# EAGLE design GrblPiArgentina (EAGLE 6.4)
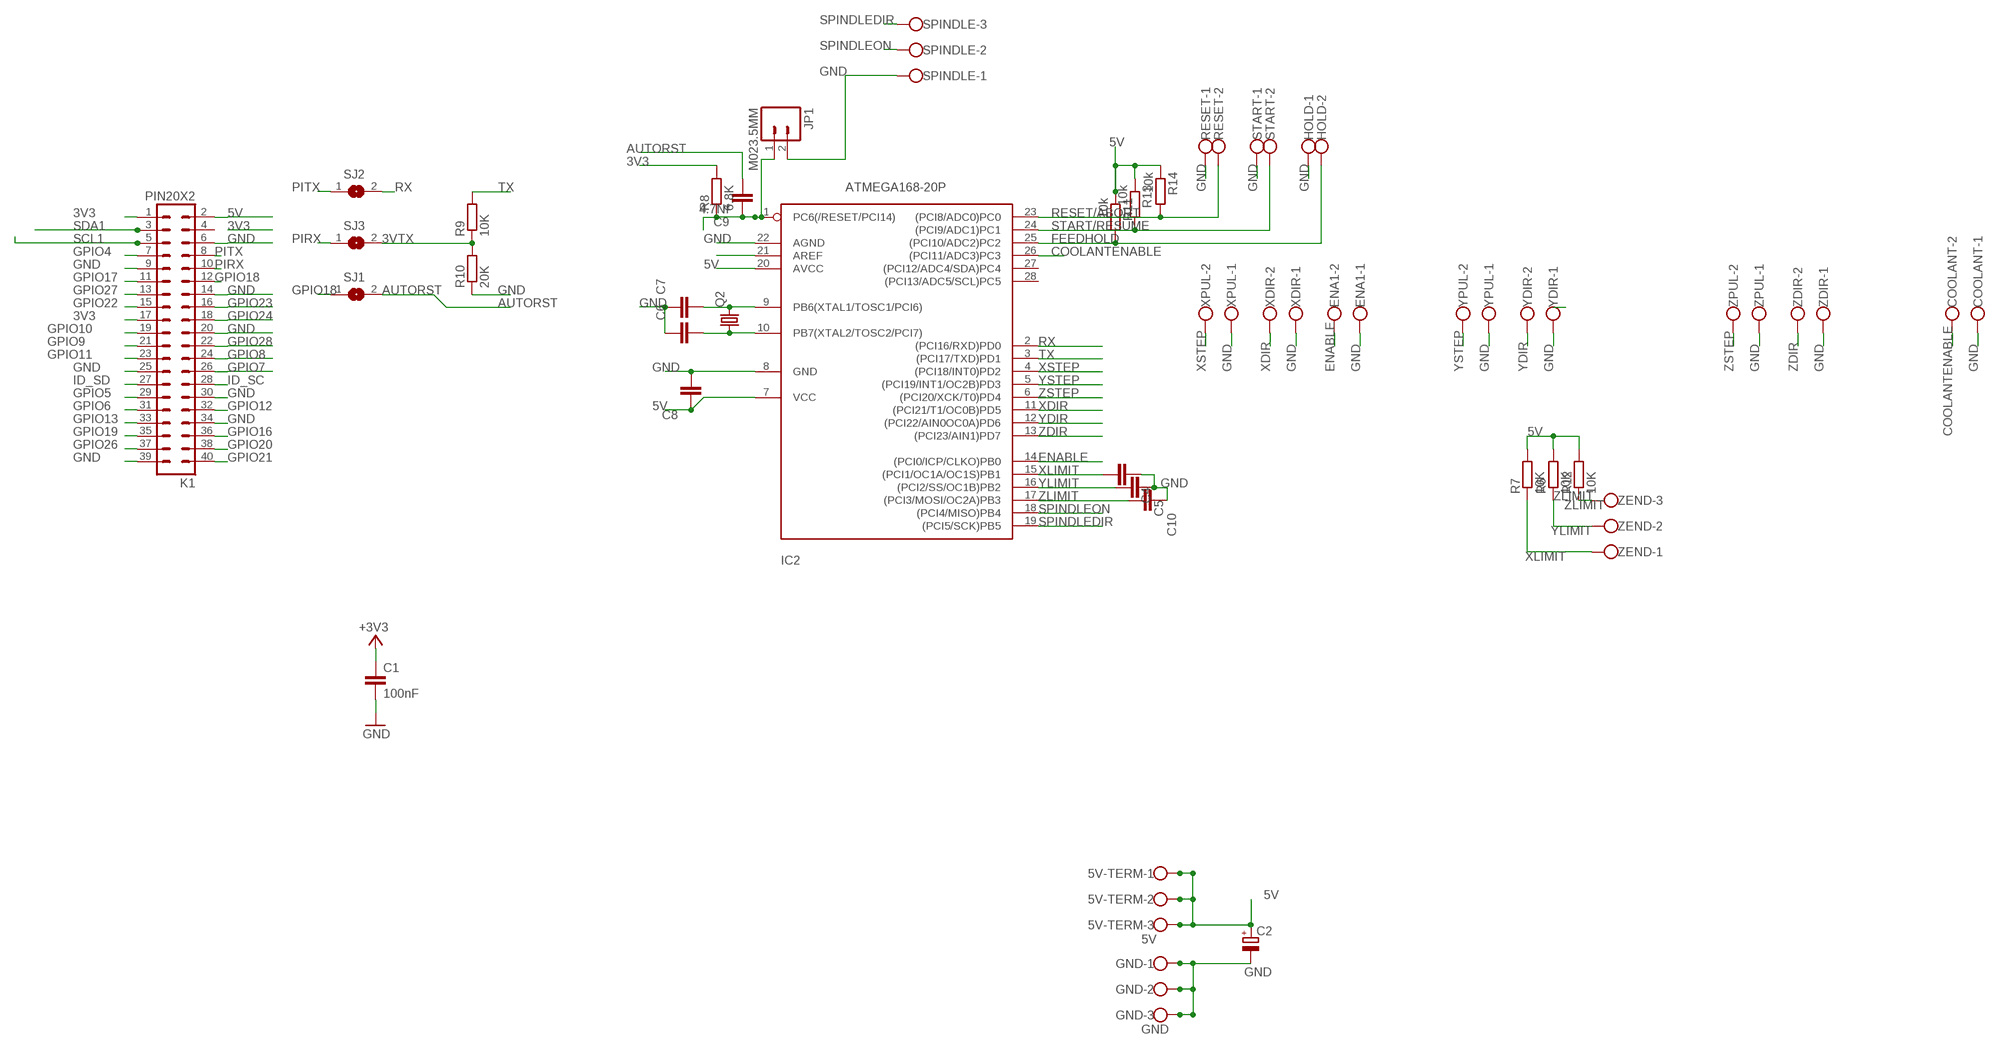
[diagram p0: schematic, sheet 1]

## Parts
5V-TERM  5V  W237-103  [W237-103]
C1  100nF  C-EU025-024X044  [C025-024X044]
C2  CPOL-EUE2,5-6E  [E2,5-6E]
C4  CAPACITOR_NPOL-PTH_0.1"  [C0.1PTH]
C5  CAPACITOR_NPOL-PTH_0.1"  [C0.1PTH]
C6  CAPACITOR_NPOL-PTH_0.1"  [C0.1PTH]
C7  CAPACITOR_NPOL-PTH_0.1"  [C0.1PTH]
C8  CAPACITOR_NPOL-PTH_0.1"  [C0.1PTH]
C9  4.7Nf  CAPACITOR_NPOL-PTH_0.1"  [C0.1PTH]
C10  CAPACITOR_NPOL-PTH_0.1"  [C0.1PTH]
COOLANT  W237-102  [W237-102]
ENA1  W237-102  [W237-102]
GND  GND  W237-103  [W237-103]
HOLD  W237-102  [W237-102]
IC2  ATMEGA168-20P  [DIL28-3]
JP1  M023.5MM  [SCREWTERMINAL-3.5MM-2]
K1  PIN20X2  [PIN_20X2]
Q2  CRYSTALHC49U70  [HC49U70]
R6  10K  R-EU_0204/7  [0204/7]
R7  10K  R-EU_0204/7  [0204/7]
R8  6.8K  R-EU_0204/7  [0204/7]
R9  10K  R-EU_0204/7  [0204/7]
R10  20K  R-EU_0204/7  [0204/7]
R11  10k  R-EU_0204/7  [0204/7]
R12  10K  R-EU_0204/7  [0204/7]
R13  10k  R-EU_0204/7  [0204/7]
R14  10k  R-EU_0204/7  [0204/7]
RESET  W237-102  [W237-102]
SJ1  SJ  [SJ]
SJ2  SJ  [SJ]
SJ3  SJ  [SJ]
SPINDLE  W237-103  [W237-103]
START  W237-102  [W237-102]
XDIR  W237-102  [W237-102]
XPUL  W237-102  [W237-102]
YDIR  W237-102  [W237-102]
YPUL  W237-102  [W237-102]
ZDIR  W237-102  [W237-102]
ZEND  W237-103  [W237-103]
ZPUL  W237-102  [W237-102]

## Nets
3V3: C1.1 K1.1 K1.17 R8.2 ; supply symbol labelled +3V3
3VTX: R9.1 R10.2 SJ3.2
5V: 5V-TERM.1 5V-TERM.2 5V-TERM.3 C2.+ C8.1 IC2.7(VCC) IC2.20(AVCC) K1.2 R6.2 R7.2 R11.1 R12.2 R13.1 R14.1
AUTORST: C9.2 SJ1.2
COOLANTENABLE: COOLANT.2 IC2.26((PCI11/ADC3)PC3)
ENABLE: ENA1.2 IC2.14((PCI0/ICP/CLKO)PB0)
FEEDHOLD: HOLD.2 IC2.25((PCI10/ADC2)PC2) R11.2
GND: C1.2 C2.- C4.1 C5.1 C6.1 C7.1 C8.2 C10.1 COOLANT.1 ENA1.1 GND.1 GND.2 GND.3 HOLD.1 IC2.8(GND) IC2.22(AGND) JP1.2 K1.6 K1.9 K1.14 K1.20 K1.25 K1.30 K1.34 K1.39 R10.1 RESET.1 SPINDLE.1 START.1 XDIR.1 XPUL.1 YDIR.1 YPUL.1 ZDIR.1 ZPUL.1
GPIO4: K1.7
GPIO5: K1.29
GPIO6: K1.31
GPIO7: K1.26
GPIO8: K1.24
GPIO9: K1.21
GPIO10: K1.19
GPIO11: K1.23
GPIO12: K1.32
GPIO13: K1.33
GPIO16: K1.36
GPIO17: K1.11
GPIO18: K1.12 SJ1.1
GPIO19: K1.35
GPIO20: K1.38
GPIO21: K1.40
GPIO22: K1.15
GPIO23: K1.16
GPIO24: K1.18
GPIO26: K1.37
GPIO27: K1.13
GPIO28: K1.22
ID_SC: K1.28
ID_SD: K1.27
MCURESET1: C9.1 IC2.1(PC6(/RESET/PCI14)) JP1.1 R8.1
N$13: IC2.21(AREF)
PIRX: K1.10 SJ3.1
PITX: K1.8 SJ2.1
RESET/ABORT: IC2.23((PCI8/ADC0)PC0) R14.2 RESET.2
RX: IC2.2((PCI16/RXD)PD0) SJ2.2
SCL1: K1.5
SDA1: K1.3
SPINDLEDIR: IC2.19((PCI5/SCK)PB5) SPINDLE.3
SPINDLEON: IC2.18((PCI4/MISO)PB4) SPINDLE.2
START/RESUME: IC2.24((PCI9/ADC1)PC1) R13.2 START.2
TX: IC2.3((PCI17/TXD)PD1) R9.2
XDIR: IC2.11((PCI21/T1/OC0B)PD5) XDIR.2
XLIMIT: C4.2 IC2.15((PCI1/OC1A/OC1S)PB1) R7.1 ZEND.1
XSTEP: IC2.4((PCI18/INT0)PD2) XPUL.2
XTAL3: C6.2 IC2.10(PB7(XTAL2/TOSC2/PCI7)) Q2.1
XTAL4: C7.2 IC2.9(PB6(XTAL1/TOSC1/PCI6)) Q2.2
YDIR: IC2.12((PCI22/AIN0OC0A)PD6) YDIR.2
YLIMIT: C5.2 IC2.16((PCI2/SS/OC1B)PB2) R6.1 ZEND.2
YSTEP: IC2.5((PCI19/INT1/OC2B)PD3) YPUL.2
ZDIR: IC2.13((PCI23/AIN1)PD7) ZDIR.2
ZLIMIT: C10.2 IC2.17((PCI3/MOSI/OC2A)PB3) R12.1 ZEND.3
ZSTEP: IC2.6((PCI20/XCK/T0)PD4) ZPUL.2
Unconnected: IC2.27((PCI12/ADC4/SDA)PC4) IC2.28((PCI13/ADC5/SCL)PC5) K1.4

## Library data of the parts
5V-TERM GND SPINDLE ZEND = con-wago-500:W237-103: WAGO SCREW CLAMP; MPN: 237-103; OC_FARNELL: unknown; OC_NEWARK: 18M7116
C1 = resistor:C-EU: CAPACITOR, European symbol; DIELECTRIC: X7R
C2 = rcl:CPOL-EU: POLARIZED CAPACITOR, European symbol
C4-C10 = dp_devices:CAPACITOR_NPOL: Non-Polarized capacitor in various packages
COOLANT ENA1 HOLD RESET START XDIR XPUL YDIR YPUL ZDIR ZPUL = con-wago-500:W237-102: WAGO SCREW CLAMP; MPN: 237-102; OC_FARNELL: unknown; OC_NEWARK: 70K9898
IC2 = adafruit:ATMEGA168*P: MICROCONTROLLER 16 kBytes FLASH 1 kBytes SRAM 512 Bytes EEPROM USART 8-channel 10 bit ADC
JP1 = SparkFun-Connectors:M02: Standard 2-pin 0.1" header. Use with - straight break away headers ( PRT-00116) - right angle break away headers (PRT-00553) - swiss pins (PRT-00743) - machine pins (PRT-00117) - female headers (PRT-00115) Molex polarized connector foot print use with: PRT-08233 with associated crimp pins and housings. 2.54_SCREWTERM for use with PRT-10571. 3.5mm Screw Terminal footprints for PRT-08084 5mm Screw Terminal footprints for use with PRT-08433
K1 = FLYFISH:PIN20X2
Q2 = adafruit:CRYSTAL: CRYSTAL; OC_FARNELL: unknown; OC_NEWARK: unknown
R6-R14 = resistor:R-EU_: RESISTOR, European symbol
SJ1-SJ3 = jumper:SJ: SMD solder JUMPER

## Board
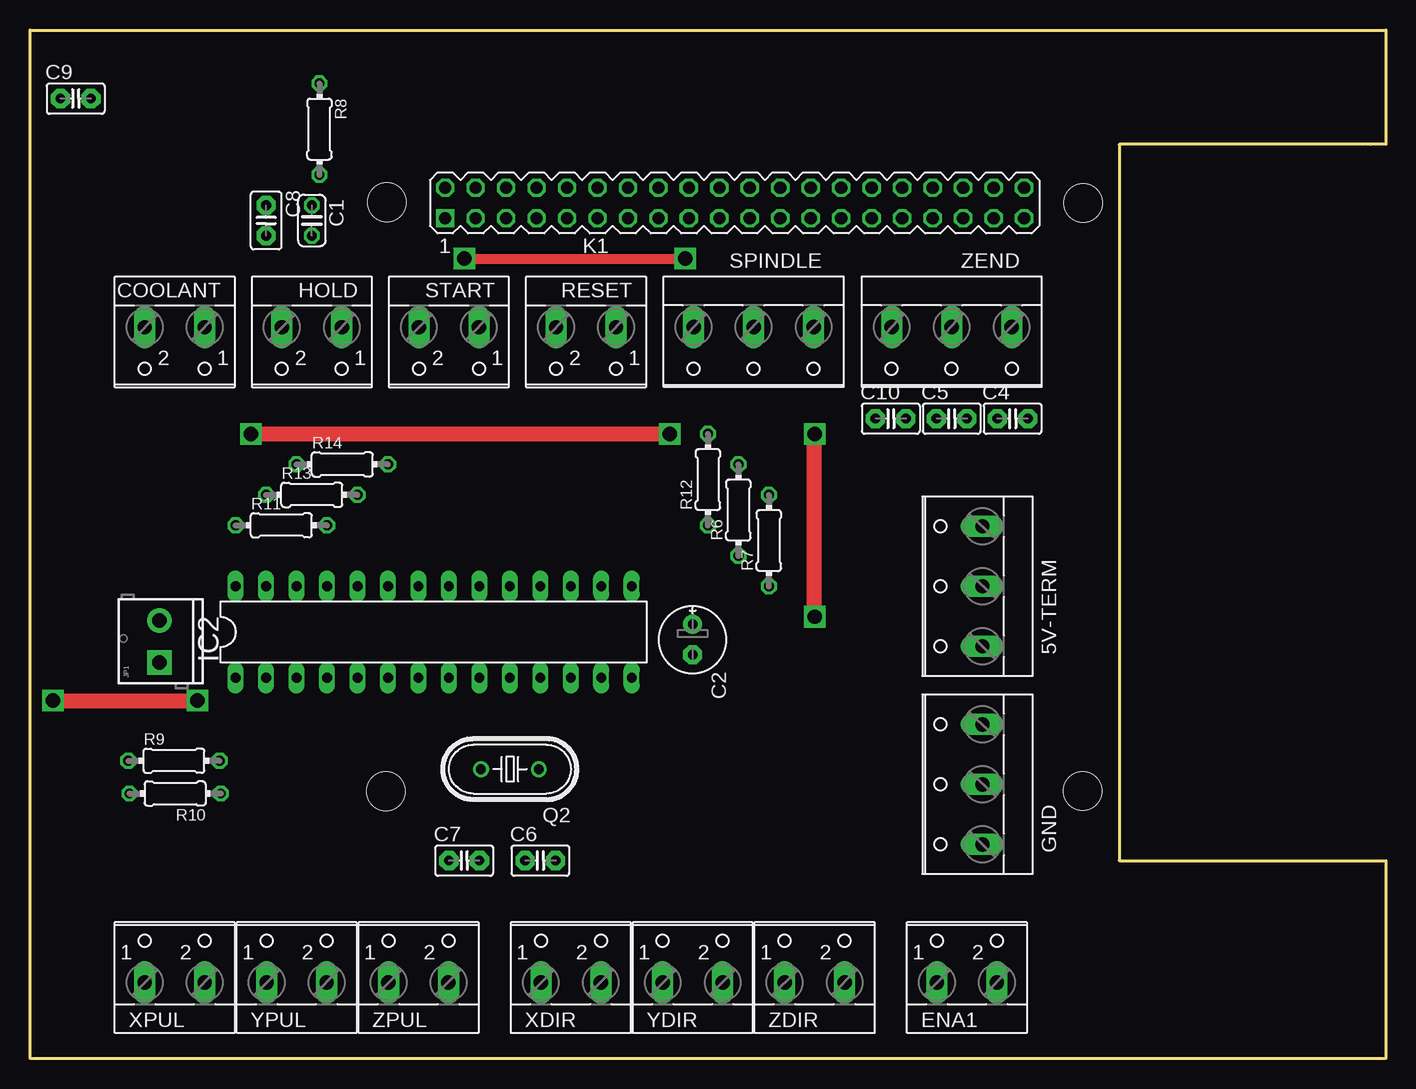
[diagram p1: board, top side]
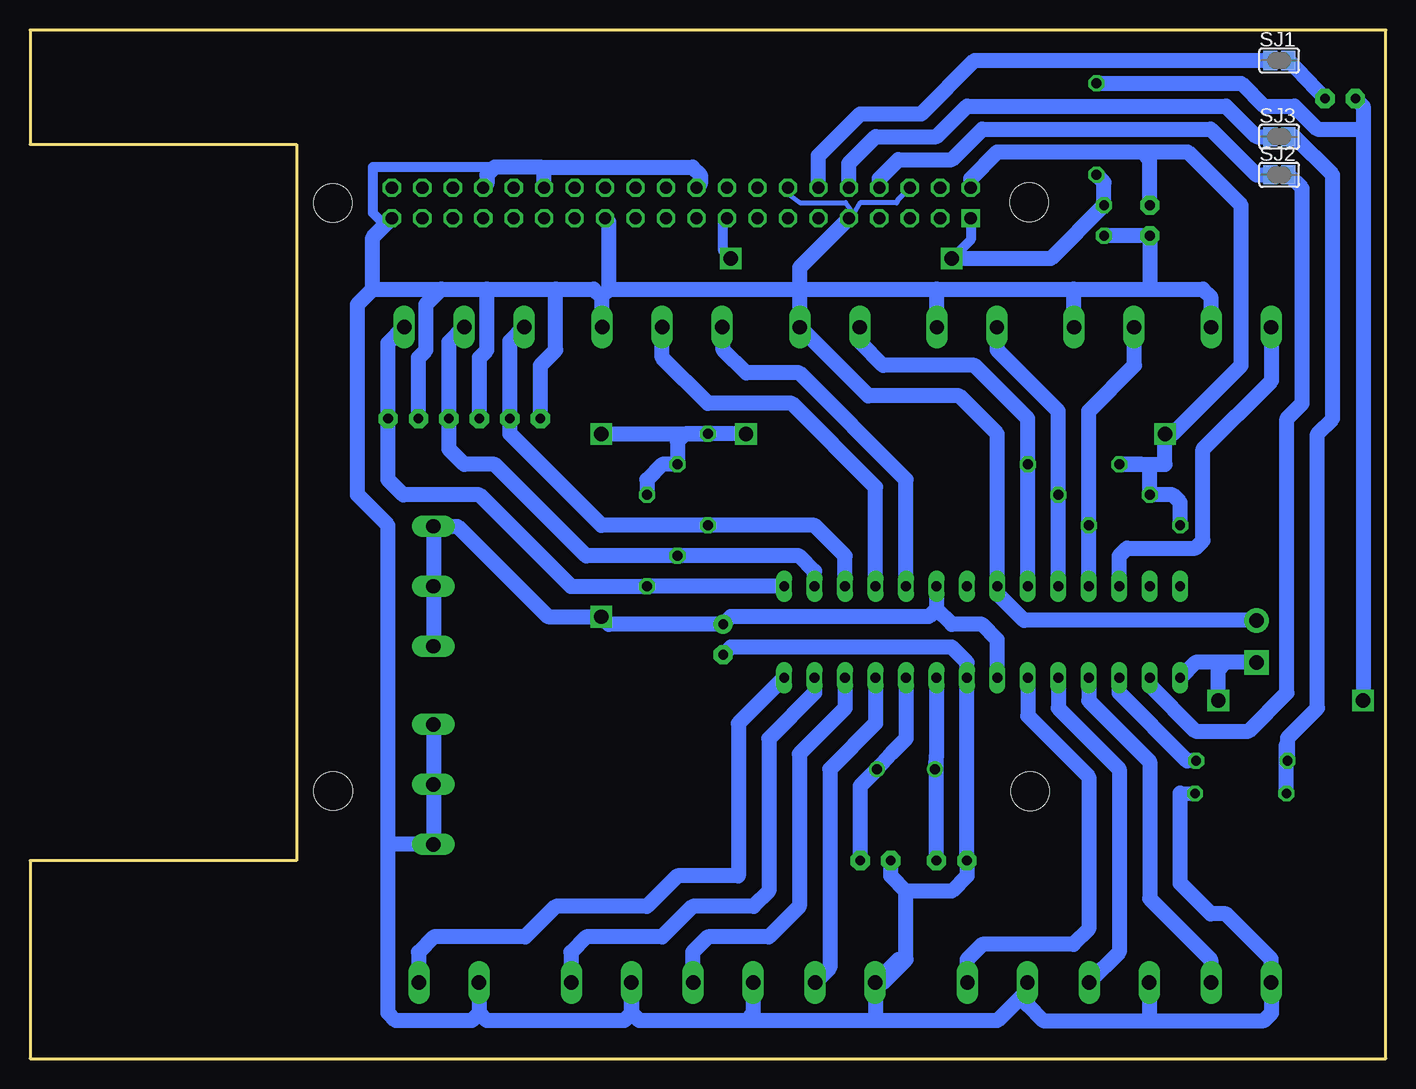
[diagram p2: board, bottom side, seen from below]

Size 113.03 x 85.72 mm. Coordinates in mm from the lower left corner, seen from the top.
Outline: 111.76,76.2 111.12,76.2 90.8,76.2 90.8,16.51 113.03,16.51 113.03,0 0,0 0,85.72 113.03,85.72 113.03,76.2 111.76,76.2
Copper layers (1*16): Top 0.035mm / dielectric 1.5mm / Bottom 0.035mm
Design rules "default": minimum track width 10mil, minimum drill 24mil, track to track 8mil, track to pad 8mil, pad to pad 8mil, via to via 8mil, smd to smd 8mil, copper to edge 40mil, drill to drill 8mil, minimum pad ring 10mil, minimum via ring 8mil, stop-mask expansion 4mil, vias tented up to drill 0mil, thermal gap 10mil
Holes 3.2 mm at 29.75,71.37 87.79,71.31 87.76,22.32 29.65,22.29

### Footprints (pad centres in the part's own frame; a part is rotated, then mirrored left to right if it is on the bottom)
W237-103 = drill 1.194 long: 1 -5,-1.29; 2 0,-1.29; 3 5,-1.29
C025-024X044 = drill 0.813 octagon: 1 -1.27,0; 2 1.27,0
E2,5-6E = drill 0.813 pad 1.575: + -1.27,0 | drill 0.813 pad 1.575 octagon: - 1.27,0
C0.1PTH = drill 0.813 pad 1.6 octagon: 1 -1.27,0; 2 1.27,0
W237-102 = drill 1.194 long: 1 -2.5,-1.27; 2 2.5,-1.27
DIL28-3 = drill 0.813 long: 1 -16.51,-3.81; 2 -13.97,-3.81; 3 -11.43,-3.81; 4 -8.89,-3.81; 5 -6.35,-3.81; 6 -3.81,-3.81; 7 -1.27,-3.81; 8 1.27,-3.81; 9 3.81,-3.81; 10 6.35,-3.81; 11 8.89,-3.81; 12 11.43,-3.81; 13 13.97,-3.81; 14 16.51,-3.81; 15 16.51,3.81; 16 13.97,3.81; 17 11.43,3.81; 18 8.89,3.81; 19 6.35,3.81; 20 3.81,3.81; 21 1.27,3.81; 22 -1.27,3.81; 23 -3.81,3.81; 24 -6.35,3.81; 25 -8.89,3.81; 26 -11.43,3.81; 27 -13.97,3.81; 28 -16.51,3.81
SCREWTERMINAL-3.5MM-2 = drill 1.2 pad 2.032 square: 1 0,0 | drill 1.2 pad 2.032: 2 3.5,0
PIN_20X2 = drill 1.016 square: 1 -24.13,-1.27 | drill 1.016 octagon: 2 -24.13,1.27; 3 -21.59,-1.27; 4 -21.59,1.27; 5 -19.05,-1.27; 6 -19.05,1.27; 7 -16.51,-1.27; 8 -16.51,1.27; 9 -13.97,-1.27; 10 -13.97,1.27; 11 -11.43,-1.27; 12 -11.43,1.27; 13 -8.89,-1.27; 14 -8.89,1.27; 15 -6.35,-1.27; 16 -6.35,1.27; 17 -3.81,-1.27; 18 -3.81,1.27; 19 -1.27,-1.27; 20 -1.27,1.27; 21 1.27,-1.27; 22 1.27,1.27; 23 3.81,-1.27; 24 3.81,1.27; 25 6.35,-1.27; 26 6.35,1.27; 27 8.89,-1.27; 28 8.89,1.27; 29 11.43,-1.27; 30 11.43,1.27; 31 13.97,-1.27; 32 13.97,1.27; 33 16.51,-1.27; 34 16.51,1.27; 35 19.05,-1.27; 36 19.05,1.27; 37 21.59,-1.27; 38 21.59,1.27; 39 24.13,-1.27; 40 24.13,1.27
HC49U70 = drill 0.813: 1 -2.413,0; 2 2.413,0
0204/7 = drill 0.813 octagon: 1 -3.81,0; 2 3.81,0
SJ = smd 1.168 x 1.6: 1 -0.762,0; 2 0.762,0

### Placement (x,y rotation side)
5V-TERM  78.1,39.37 90 top
C1  23.49,69.85 270 top
C2  55.24,34.93 270 top
C4  81.91,53.34 0 top
C5  76.84,53.34 0 top
C6  42.54,16.51 0 top
C7  36.2,16.51 0 top
C8  19.68,69.85 270 top
C9  3.81,80.01 0 top
C10  71.75,53.34 0 top
COOLANT  12.06,59.69 180 top
ENA1  78.1,7.62 0 top
GND  78.1,22.86 90 top
HOLD  23.49,59.69 180 top
IC2  33.65,35.56 0 top
JP1  10.8,33.02 90 top
K1  58.74,71.31 0 top
Q2  40.01,24.13 180 top
R6  59.05,45.72 90 top
R7  61.6,43.18 90 top
R8  24.13,77.47 270 top
R9  12,24.83 0 top
R10  12.1,22.1 180 top
R11  20.96,44.45 0 top
R12  56.51,48.26 90 top
R13  23.49,46.99 0 top
R14  26.04,49.53 0 top
RESET  46.35,59.69 180 top
SJ1  8.89,83.19 0 bottom
SJ2  8.89,73.66 0 bottom
SJ3  8.89,76.84 0 bottom
SPINDLE  60.32,59.69 180 top
START  34.93,59.69 180 top
XDIR  45.09,7.62 0 top
XPUL  12.06,7.62 0 top
YDIR  55.24,7.62 0 top
YPUL  22.23,7.62 0 top
ZDIR  65.41,7.62 0 top
ZEND  76.84,59.69 180 top
ZPUL  32.38,7.62 0 top

### Tracks (layer width: path | path; a pad name or v marks a point on that pad's centre or on a via)
3V3  (via drill 1.2)
  Top 0.813: v36.2,66.67 v54.61,66.67
  Bottom 0.813: K1.1 34.61,68.26 v36.2,66.67 | v54.61,66.67 55.24,67.31 55.24,69.72 K1.17
  Bottom 1.27: v36.2,66.67 27.94,66.67 C1.1 23.49,73.03 R8.2
3VTX
  Bottom 1.27: R10.2 8.29,26.19 R9.1 8.19,26.73 5.71,29.21 5.71,52.07 4.45,53.34 4.45,73.66 7.62,76.84 SJ3.2
5V  (via drill 1.2)
  Top 1.27: v18.41,52.07 v53.34,52.07 | v65.41,36.83 v65.41,52.07
  Bottom 1.27: R12.2 58.42,52.07 59.05,51.44 R6.2 60.32,49.53 61.6,48.26 R7.2 | 20.32,49.53 R14.1 19.68,49.53 | 19.68,49.53 18.41,49.53 v18.41,52.07 17.78,52.07 12.06,57.78 12.06,71.12 16.51,75.56 20.32,75.56 | v53.34,52.07 R12.2 | R11.1 17.14,46.36 17.78,46.99 R13.1 19.68,49.53 | v65.41,52.07 R12.2 | IC2.20 37.46,37.47 | 37.46,37.47 38.1,36.83 54.61,36.83 C2.+ 64.77,36.2 v65.41,36.83 69.85,36.83 77.39,44.37 5V-TERM.3 5V-TERM.2 5V-TERM.1 | IC2.7 32.38,34.93 33.65,36.2 36.2,36.2 37.46,37.47 | K1.2 34.61,73.34 32.38,75.56 20.32,75.56 | C8.1 19.68,74.93 20.32,75.56
AUTORST
  Bottom 1.27: SJ1.2 C9.2
COOLANTENABLE
  Bottom 1.27: IC2.26 22.23,41.91 21.59,42.55 15.88,42.55 15.24,43.18 15.24,50.8 9.52,56.52 9.52,60.92 COOLANT.2
ENABLE
  Bottom 1.27: IC2.14 53.98,27.94 53.98,15.24 59.05,15.24 61.6,12.7 69.22,12.7 71.75,10.16 79.38,10.16 80.65,8.89 80.65,6.39 ENA1.2
FEEDHOLD
  Bottom 1.27: IC2.25 R11.2 24.76,53.97 20.96,57.78 20.96,60.92 HOLD.2
GND
  Bottom 0.406: 44.39,70.42 43.83,71.32 40.78,71.32 40.64,71.63 K1.6 | 44.39,70.42 K1.9 | K1.14 49.85,72.07 48.85,71.33 45.04,71.33 44.39,70.42
  Bottom 0.813: 70.48,74.3 84.45,74.3 84.45,70.48 83.82,69.85 83.06,69.85 K1.39
  Bottom 1.27: C4.1 80.65,58.42 80.01,59.06 80.01,62.86 78.74,64.14 | 78.74,64.14 74.93,64.14 | 74.93,64.14 69.22,64.14 | 69.22,64.14 66.04,64.14 65.41,63.5 65.41,61.06 SPINDLE.1 65.32,63.58 64.77,64.14 | C5.1 75.56,58.42 74.93,59.06 74.93,64.14 | C10.1 70.48,57.78 69.22,59.06 69.22,64.14 | 64.77,64.14 48.9,64.14 | 48.9,64.14 37.46,64.14 | 37.46,64.14 26.04,64.14 | 26.04,64.14 19.68,64.14 | 19.68,64.14 15.24,64.14 14.6,63.5 14.6,61 COOLANT.1 | HOLD.1 25.99,64.09 26.04,64.14 | START.1 37.43,64.09 37.46,64.14 | 48.85,64.09 RESET.1 43.14,55.25 35.56,55.25 32.38,52.07 IC2.22 32.38,38.73 30.17,36.52 JP1.2 | 48.85,64.09 48.9,64.14 | 40.01,13.97 36.2,13.97 34.93,15.24 C7.1 IC2.8 34.93,33.02 36.2,34.29 54.61,34.29 C2.- | 40.01,13.97 41.27,15.24 C6.1 | XDIR.1 42.54,6.35 | 42.54,6.35 41.91,6.35 40.01,8.26 | 40.01,8.26 40.01,13.97 | 42.54,3.17 32.38,3.17 29.88,5.67 ZPUL.1 29.88,4.48 28.57,3.17 19.68,3.17 | 42.54,3.17 53.34,3.17 | 53.34,3.17 62.23,3.17 62.87,3.81 62.87,6.31 ZDIR.1 62.9,3.77 63.5,3.17 74.93,3.17 75.56,3.81 75.56,6.31 ENA1.1 75.6,3.77 76.2,3.17 82.55,3.17 83.19,3.81 83.19,17.78 | YDIR.1 52.74,3.77 53.34,3.17 | 40.01,8.26 40.64,8.26 42.54,6.35 | 42.54,6.35 42.54,3.17 | 19.68,3.17 10.16,3.17 9.52,3.81 9.52,6.31 XPUL.1 9.56,8.29 13.34,12.06 14.6,12.06 17.14,14.6 17.14,22.13 R10.1 | YPUL.1 19.73,3.21 19.68,3.17 | 83.19,17.78 83.19,44.45 85.72,46.99 85.72,62.86 84.45,64.14 | 84.45,64.14 78.74,64.14 | GND.3 79.4,23.52 79.38,23.5 79.38,22.88 GND.2 GND.1 83.1,17.86 83.19,17.78 | 64.77,64.14 64.77,69.72 K1.25 | 84.45,64.14 84.45,68.45 K1.39 | 70.48,74.3 74.29,74.3 74.93,73.66 74.93,72.9 K1.34 | K1.30 70.17,73.98 70.48,74.3
  Bottom 1.27: 70.48,74.3 57.79,74.3 57.15,73.66 57.15,72.9 K1.20 | 48.85,64.09 48.85,65.95 K1.9 | 19.68,64.14 C8.2 C1.2
GPIO18
  Bottom 1.27: K1.12 47.31,75.25 43.82,78.74 38.73,78.74 34.29,83.19 SJ1.1
MCURESET1  (via drill 1.2)
  Top 1.27: v1.91,29.84 v13.97,29.84
  Bottom 1.27: JP1.1 13.34,33.02 | 13.34,33.02 15.88,33.02 IC2.1 | C9.1 1.91,79.38 1.91,77.47 | 1.91,77.47 v1.91,29.84 | v13.97,29.84 13.97,32.38 13.34,33.02 | R8.1 12.06,81.28 10.16,79.38 7.62,79.38 5.71,77.47 1.91,77.47
PIRX
  Bottom 1.27: K1.10 44.77,74.61 42.54,76.84 37.46,76.84 34.93,79.38 13.34,79.38 10.8,76.84 SJ3.1
PITX
  Bottom 1.27: K1.8 42.23,73.34 40.64,74.93 36.2,74.93 33.65,77.47 14.6,77.47 10.8,73.66 SJ2.1
RESET/ABORT
  Bottom 1.27: IC2.23 R14.2 29.85,53.34 34.29,57.78 41.91,57.78 43.82,59.69 43.82,60.92 RESET.2
RX
  Bottom 1.27: IC2.2 19.68,31.12 15.88,27.3 11.43,27.3 8.26,30.48 8.26,53.34 6.98,54.61 6.98,72.52 SJ2.2
SPINDLEDIR
  Bottom 1.27: IC2.19 40.01,48.26 48.9,57.15 53.34,57.15 55.24,59.06 55.24,60.9 SPINDLE.3
SPINDLEON
  Bottom 1.27: IC2.18 42.54,47.62 49.53,54.61 56.51,54.61 60.32,58.42 SPINDLE.2
START/RESUME
  Bottom 1.27: IC2.24 R13.2 27.3,53.97 32.38,59.06 32.38,60.92 START.2
TX
  Bottom 1.27: R9.2 16.57,24.83 22.23,30.48 IC2.3
XDIR
  Bottom 1.27: IC2.11 42.54,27.94 46.35,24.13 46.35,7.58 XDIR.2
XLIMIT
  Bottom 1.27: IC2.15 R7.1 67.94,39.37 75.56,46.99 81.91,46.99 83.19,48.26 C4.2 83.19,59.63 ZEND.1
XSTEP
  Bottom 1.27: XPUL.2 14.6,6.39 14.6,8.26 19.68,13.33 19.68,24.77 24.76,29.84 IC2.4
XTAL3
  Bottom 1.27: IC2.10 40.01,26.67 41.27,25.4 Q2.1 43.82,22.73 C6.2
XTAL4
  Bottom 1.27: IC2.9 37.46,25.53 Q2.2 37.46,25.27 C7.2
YDIR
  Bottom 1.27: IC2.12 45.09,29.21 48.9,25.4 48.9,12.7 51.43,10.16 56.51,10.16 57.79,8.89 57.79,6.35 YDIR.2
YLIMIT
  Bottom 1.27: IC2.16 47.62,40.64 48.9,41.91 R6.1 66.68,41.91 74.29,49.53 76.84,49.53 78.1,50.8 C5.2 78.1,59.71 ZEND.2
YSTEP
  Bottom 1.27: IC2.5 27.3,29.21 22.23,24.13 22.23,8.89 24.76,6.39 YPUL.2
ZDIR
  Bottom 1.27: IC2.13 47.62,30.48 51.43,26.67 51.43,13.97 52.71,12.7 57.79,12.7 60.32,10.16 66.68,10.16 67.94,8.89 67.94,6.39 ZDIR.2
ZLIMIT
  Bottom 1.27: IC2.17 45.09,41.91 47.62,44.45 R12.1 65.41,44.45 73.03,52.07 C10.2 73.03,59.79 ZEND.3
ZSTEP
  Bottom 1.27: IC2.6 29.85,28.58 24.76,23.5 24.76,10.79 26.04,9.53 33.65,9.53 34.93,8.26 34.93,6.39 ZPUL.2

### Text on the board
OHSILK: SPINDIR | GND | GND | GND | GND | SPINDLE | GND | ZMIN | YMIN | ZMIN | 5V | 5V | GND | GND | GND | GND | GND | GND | GND | GND | GND